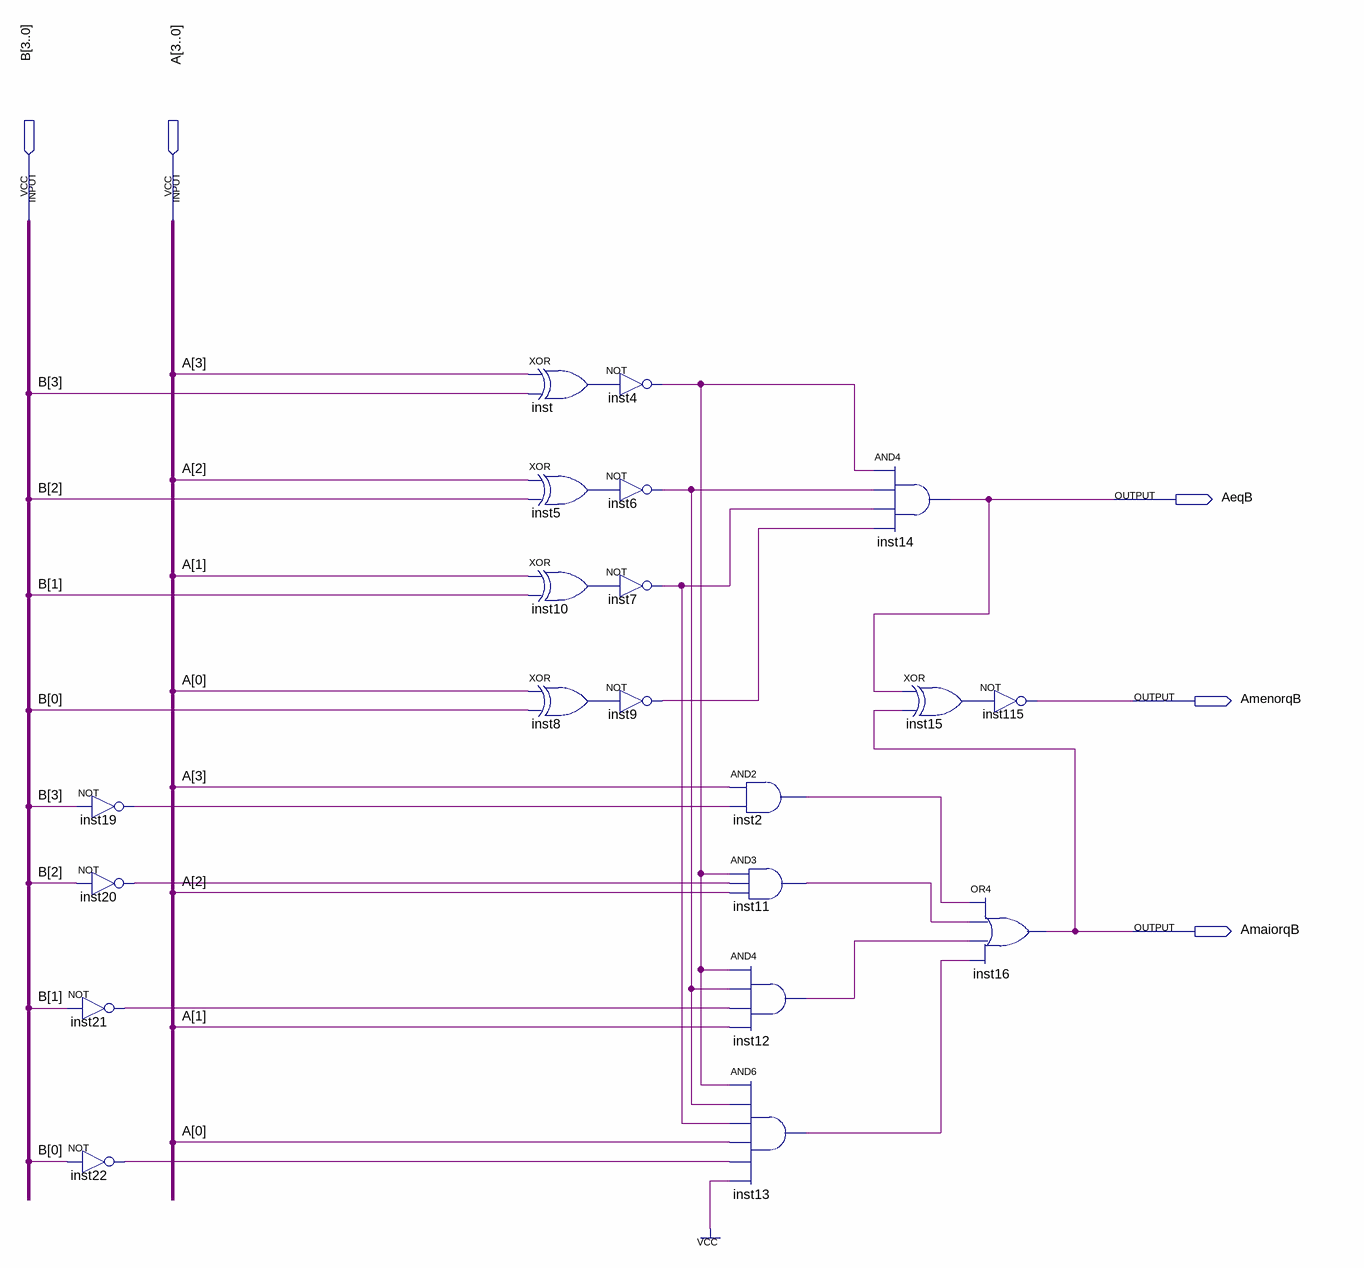
[diagram p0: schematic sheet]
// Quartus schematic ComparadorNsignal.bdf as structural Verilog: 20 symbols, 5 pins
module ComparadorNsignal (
  input  [3:0] B,
  input  [3:0] A,
  output AeqB,
  output AmenorqB,
  output AmaiorqB
);

  wire inst2_out, inst4_out, inst5_out, inst6_out, inst7_out, inst8_out, inst9_out, inst10_out, inst11_out,
       inst12_out, inst13_out, inst15_out, inst19_out, inst20_out, inst21_out, inst22_out, inst_out;

  not inst19 (inst19_out, B[3]);
  not inst20 (inst20_out, B[2]);
  not inst21 (inst21_out, B[1]);
  not inst22 (inst22_out, B[0]);
  xor inst (inst_out, A[3], B[3]);
  xor inst5 (inst5_out, A[2], B[2]);
  xor inst10 (inst10_out, A[1], B[1]);
  xor inst8 (inst8_out, A[0], B[0]);
  not inst4 (inst4_out, inst_out);
  not inst6 (inst6_out, inst5_out);
  not inst7 (inst7_out, inst10_out);
  not inst9 (inst9_out, inst8_out);
  and inst2 (inst2_out, A[3], inst19_out);
  and inst11 (inst11_out, inst4_out, inst20_out, A[2]);
  and inst12 (inst12_out, inst4_out, inst6_out, inst21_out, A[1]);
  and inst13 (inst13_out, inst4_out, inst6_out, inst7_out, A[0], inst22_out, 1'b1);
  and inst14 (AeqB, inst4_out, inst6_out, inst7_out, inst9_out);
  xor inst15 (inst15_out, AeqB, AmaiorqB);
  not inst115 (AmenorqB, inst15_out);
  or inst16 (AmaiorqB, inst2_out, inst11_out, inst12_out, inst13_out);
endmodule
